# EAGLE schematic b pubsub_lower_bore_isolate 5V (EAGLE 9.4.2)
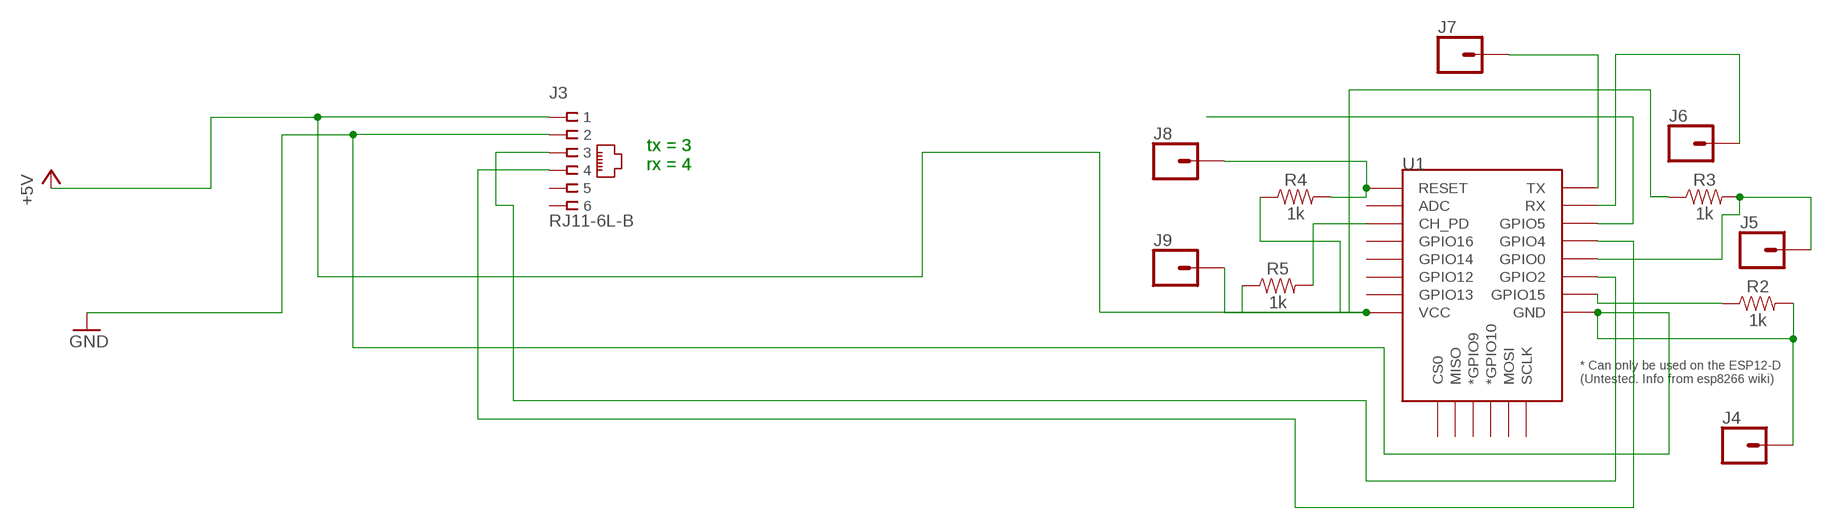
[diagram p0: schematic, sheet 1]

## Parts
J3  RJ11-6L-B  [RJ11-NO_SHIELD]
J4  CONN_01  [1X01]
J5  CONN_01  [1X01]
J6  CONN_01  [1X01]
J7  CONN_01  [1X01]
J8  CONN_01  [1X01]
J9  CONN_01  [1X01]
R2  1k  1KOHM-HORIZ-1/4W-1%  [AXIAL-0.3]
R3  1k  1KOHM-HORIZ-1/4W-1%  [AXIAL-0.3]
R4  1k  1KOHM-HORIZ-1/4W-1%  [AXIAL-0.3]
R5  1k  1KOHM-HORIZ-1/4W-1%  [AXIAL-0.3]
U1  ESP12ESMD  [ESP12E-SMD]

## Nets
+5V: J3.1 J9.1 R3.P$1 R4.P$1 R5.P$1 U1.VCC
GND: J3.2 J4.1 R2.P$2 U1.GND
N$1: J3.4 U1.GPIO4
N$3: R2.P$1 U1.GPIO15
N$4: J5.1 R3.P$2 U1.GPIO0
N$7: U1.GPIO5
N$13: J3.3 U1.GPIO2
N$14: J7.1 U1.TXD0(TX)
N$15: J6.1 U1.RXD0(RX)
N$16: J8.1 R4.P$2 U1.RESET
N$18: R5.P$2 U1.CH_PD
Unconnected: J3.5 J3.6 U1.ADC U1.CS0 U1.GPIO9(*GPIO9) U1.GPIO10(*GPIO10) U1.GPIO12 U1.GPIO13 U1.GPIO14 U1.GPIO16 U1.MISO U1.MOSI U1.SCLK

## Notes on the sheet
- tx = 3
  rx = 4
- tx = 3
  rx = 4

## Library data of the parts
J3 = con-tycoelectronics:RJ11: CORCOM Modular RJ Jacks No Shield Source: www.tycoelectronics.com .. ENG_DS_1654001_1099_RJ_L_0507.pdf; MF: TYCO ELECTRONICS; MPN: RJ11-6L-B; OC_FARNELL: unknown; OC_NEWARK: 52K3613
J4-J9 = SparkFun-Connectors:CONN_01: Single connection point. Often used as Generic Header-pin footprint for 0.1 inch spaced/style header connections On any of the 0.1 inch spaced packages, you can populate with these: Break Away Headers - Straight <https://www.sparkfun.com/products/116> (PRT-00116) Break Away Male Headers - Right Angle <https://www.sparkfun.com/products/553> (PRT-00553) Female Headers <https://www.sparkfun.com/products/115> (PRT-00115) Break Away Headers - Machine Pin <https://www.sparkfun.com/products/117> (PRT-00117) Break Away Female Headers - Swiss Machine Pin <https://www.sparkfun.com/products/743> (PRT-00743) This device is also useful as a general connection point to wire up your design to another part of your project. Our various solder wires solder well into these plated through hole pads. Hook-Up Wire - Assortment (Stranded, 22 AWG) <https://www.sparkfun.com/products/11375> (PRT-11375) Hook-Up Wire - Assortment (Solid Core, 22 AWG) <https://www.sparkfun.com/products/11367> (PRT-11367) View the entire wire category on our website here <https://www.sparkfun.com/categories/141> Special notes: SMTSO-256-ET is a "flush mount" nut for a 4-40 screw. We mostly use this on specialty testbeds; it is a nice way to connect hardware to your PCB at an adjustable hieght. Also note, the SNAP packages are for using a snappable style connector. We sell a baggie of snaps and they are also used on two LilyPad designs: Snap Assortment - 30 pack (male and female) <https://www.sparkfun.com/products/11347> (DEV-11347) LilyPad Arduino SimpleSnap <https://www.sparkfun.com/products/10941> (DEV-10941) LilyPad SimpleSnap Protoboard <https://www.sparkfun.com/products/10940> (DEV-10940)
R2-R5 = SparkFun-Resistors:1KOHM: 1kΩ resistor A resistor is a passive two-terminal electrical component that implements electrical resistance as a circuit element. Resistors act to reduce current flow, and, at the same time, act to lower voltage levels within circuits. - Wikipedia; PROD_ID: RES-12182
U1 = esp8266modules:ESP12E: ESP12E Module